# Altium schematic sheet topLevel.SchDoc: Edison Gateway - Top Level
size Letter; Author: Ye-Sheng Kuo; DocumentNumber: 1; Revision: 3; SheetNumber: 1; SheetTotal: 10
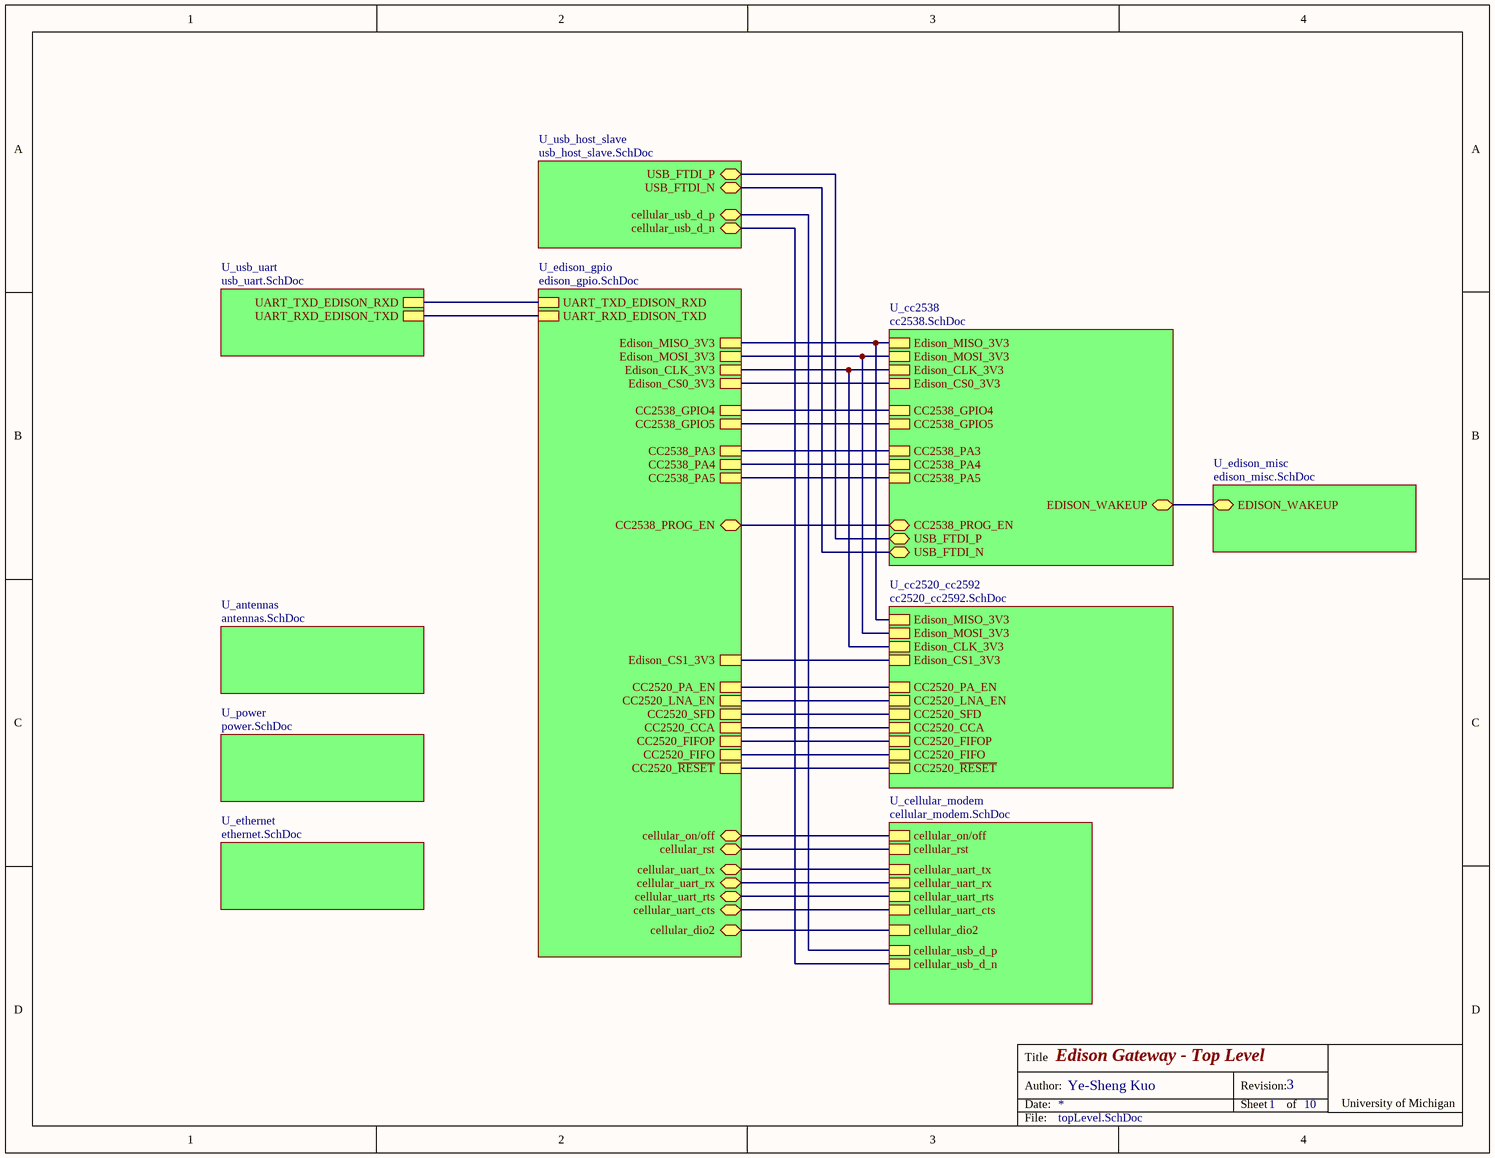
[diagram p0: topLevel.SchDoc]

## Sub-sheets
U_antennas = antennas.SchDoc: no entries
U_cc2520_cc2592 = cc2520_cc2592.SchDoc: CC2520_PA_EN, CC2520_LNA_EN, CC2520_SFD, CC2520_CCA, CC2520_FIFOP, CC2520_FIFO, CC2520_~{RESET}, Edison_MISO_3V3, Edison_MOSI_3V3, Edison_CLK_3V3, Edison_CS1_3V3
U_cc2538 = cc2538.SchDoc: CC2538_PA3, CC2538_PA4, CC2538_PA5, Edison_MISO_3V3, Edison_MOSI_3V3, Edison_CLK_3V3, Edison_CS0_3V3, CC2538_GPIO4, CC2538_GPIO5, EDISON_WAKEUP, CC2538_PROG_EN, USB_FTDI_P, USB_FTDI_N
U_cellular_modem = cellular_modem.SchDoc: cellular_on/off, cellular_rst, cellular_usb_d_p, cellular_usb_d_n, cellular_uart_tx, cellular_uart_rx, cellular_uart_rts, cellular_uart_cts, cellular_dio2
U_edison_gpio = edison_gpio.SchDoc: UART_TXD_EDISON_RXD, UART_RXD_EDISON_TXD, Edison_MISO_3V3, Edison_MOSI_3V3, Edison_CLK_3V3, Edison_CS0_3V3, CC2538_GPIO4, CC2538_GPIO5, CC2538_PA3, CC2538_PA4, CC2538_PA5, Edison_CS1_3V3, CC2520_PA_EN, CC2520_LNA_EN, CC2520_SFD, CC2520_CCA, CC2520_FIFOP, CC2520_FIFO, CC2520_~{RESET}, CC2538_PROG_EN, cellular_on/off, cellular_uart_tx, cellular_uart_rx, cellular_uart_rts, cellular_rst, cellular_uart_cts, cellular_dio2
U_edison_misc = edison_misc.SchDoc: EDISON_WAKEUP
U_ethernet = ethernet.SchDoc: no entries
U_power = power.SchDoc: no entries
U_usb_host_slave = usb_host_slave.SchDoc: USB_FTDI_N, USB_FTDI_P, cellular_usb_d_p, cellular_usb_d_n
U_usb_uart = usb_uart.SchDoc: UART_TXD_EDISON_RXD, UART_RXD_EDISON_TXD

## Nets
(unnamed): sheet U_cc2538/CC2538_PA3, sheet U_edison_gpio/CC2538_PA3
(unnamed): sheet U_cc2538/CC2538_PA4, sheet U_edison_gpio/CC2538_PA4
(unnamed): sheet U_cc2538/CC2538_PA5, sheet U_edison_gpio/CC2538_PA5
(unnamed): sheet U_cc2538/Edison_MISO_3V3, sheet U_edison_gpio/Edison_MISO_3V3, sheet U_cc2520_cc2592/Edison_MISO_3V3
(unnamed): sheet U_cc2538/Edison_MOSI_3V3, sheet U_edison_gpio/Edison_MOSI_3V3, sheet U_cc2520_cc2592/Edison_MOSI_3V3
(unnamed): sheet U_cc2538/Edison_CLK_3V3, sheet U_edison_gpio/Edison_CLK_3V3, sheet U_cc2520_cc2592/Edison_CLK_3V3
(unnamed): sheet U_cc2538/Edison_CS0_3V3, sheet U_edison_gpio/Edison_CS0_3V3
(unnamed): sheet U_cc2538/CC2538_GPIO4, sheet U_edison_gpio/CC2538_GPIO4
(unnamed): sheet U_cc2538/CC2538_GPIO5, sheet U_edison_gpio/CC2538_GPIO5
(unnamed): sheet U_cc2538/EDISON_WAKEUP, sheet U_edison_misc/EDISON_WAKEUP
(unnamed): sheet U_cc2538/CC2538_PROG_EN, sheet U_edison_gpio/CC2538_PROG_EN
(unnamed): sheet U_cc2538/USB_FTDI_P, sheet U_usb_host_slave/USB_FTDI_P
(unnamed): sheet U_cc2538/USB_FTDI_N, sheet U_usb_host_slave/USB_FTDI_N
(unnamed): sheet U_edison_gpio/UART_TXD_EDISON_RXD, sheet U_usb_uart/UART_TXD_EDISON_RXD
(unnamed): sheet U_edison_gpio/UART_RXD_EDISON_TXD, sheet U_usb_uart/UART_RXD_EDISON_TXD
(unnamed): sheet U_edison_gpio/Edison_CS1_3V3, sheet U_cc2520_cc2592/Edison_CS1_3V3
(unnamed): sheet U_edison_gpio/CC2520_PA_EN, sheet U_cc2520_cc2592/CC2520_PA_EN
(unnamed): sheet U_edison_gpio/CC2520_LNA_EN, sheet U_cc2520_cc2592/CC2520_LNA_EN
(unnamed): sheet U_edison_gpio/CC2520_SFD, sheet U_cc2520_cc2592/CC2520_SFD
(unnamed): sheet U_edison_gpio/CC2520_CCA, sheet U_cc2520_cc2592/CC2520_CCA
(unnamed): sheet U_edison_gpio/CC2520_FIFOP, sheet U_cc2520_cc2592/CC2520_FIFOP
(unnamed): sheet U_edison_gpio/CC2520_FIFO, sheet U_cc2520_cc2592/CC2520_FIFO
(unnamed): sheet U_edison_gpio/CC2520_~{RESET}, sheet U_cc2520_cc2592/CC2520_~{RESET}
(unnamed): sheet U_edison_gpio/cellular_on/off, sheet U_cellular_modem/cellular_on/off
(unnamed): sheet U_edison_gpio/cellular_uart_tx, sheet U_cellular_modem/cellular_uart_tx
(unnamed): sheet U_edison_gpio/cellular_uart_rx, sheet U_cellular_modem/cellular_uart_rx
(unnamed): sheet U_edison_gpio/cellular_uart_rts, sheet U_cellular_modem/cellular_uart_rts
(unnamed): sheet U_edison_gpio/cellular_rst, sheet U_cellular_modem/cellular_rst
(unnamed): sheet U_edison_gpio/cellular_uart_cts, sheet U_cellular_modem/cellular_uart_cts
(unnamed): sheet U_edison_gpio/cellular_dio2, sheet U_cellular_modem/cellular_dio2
(unnamed): sheet U_usb_host_slave/cellular_usb_d_p, sheet U_cellular_modem/cellular_usb_d_p
(unnamed): sheet U_usb_host_slave/cellular_usb_d_n, sheet U_cellular_modem/cellular_usb_d_n

## Notes on the sheet
- Title
- Date:
- Author:
- Revision:
- Sheet
- of
- University of Michigan
- File: